# EAGLE design arm_debug (EAGLE 9.5.1)
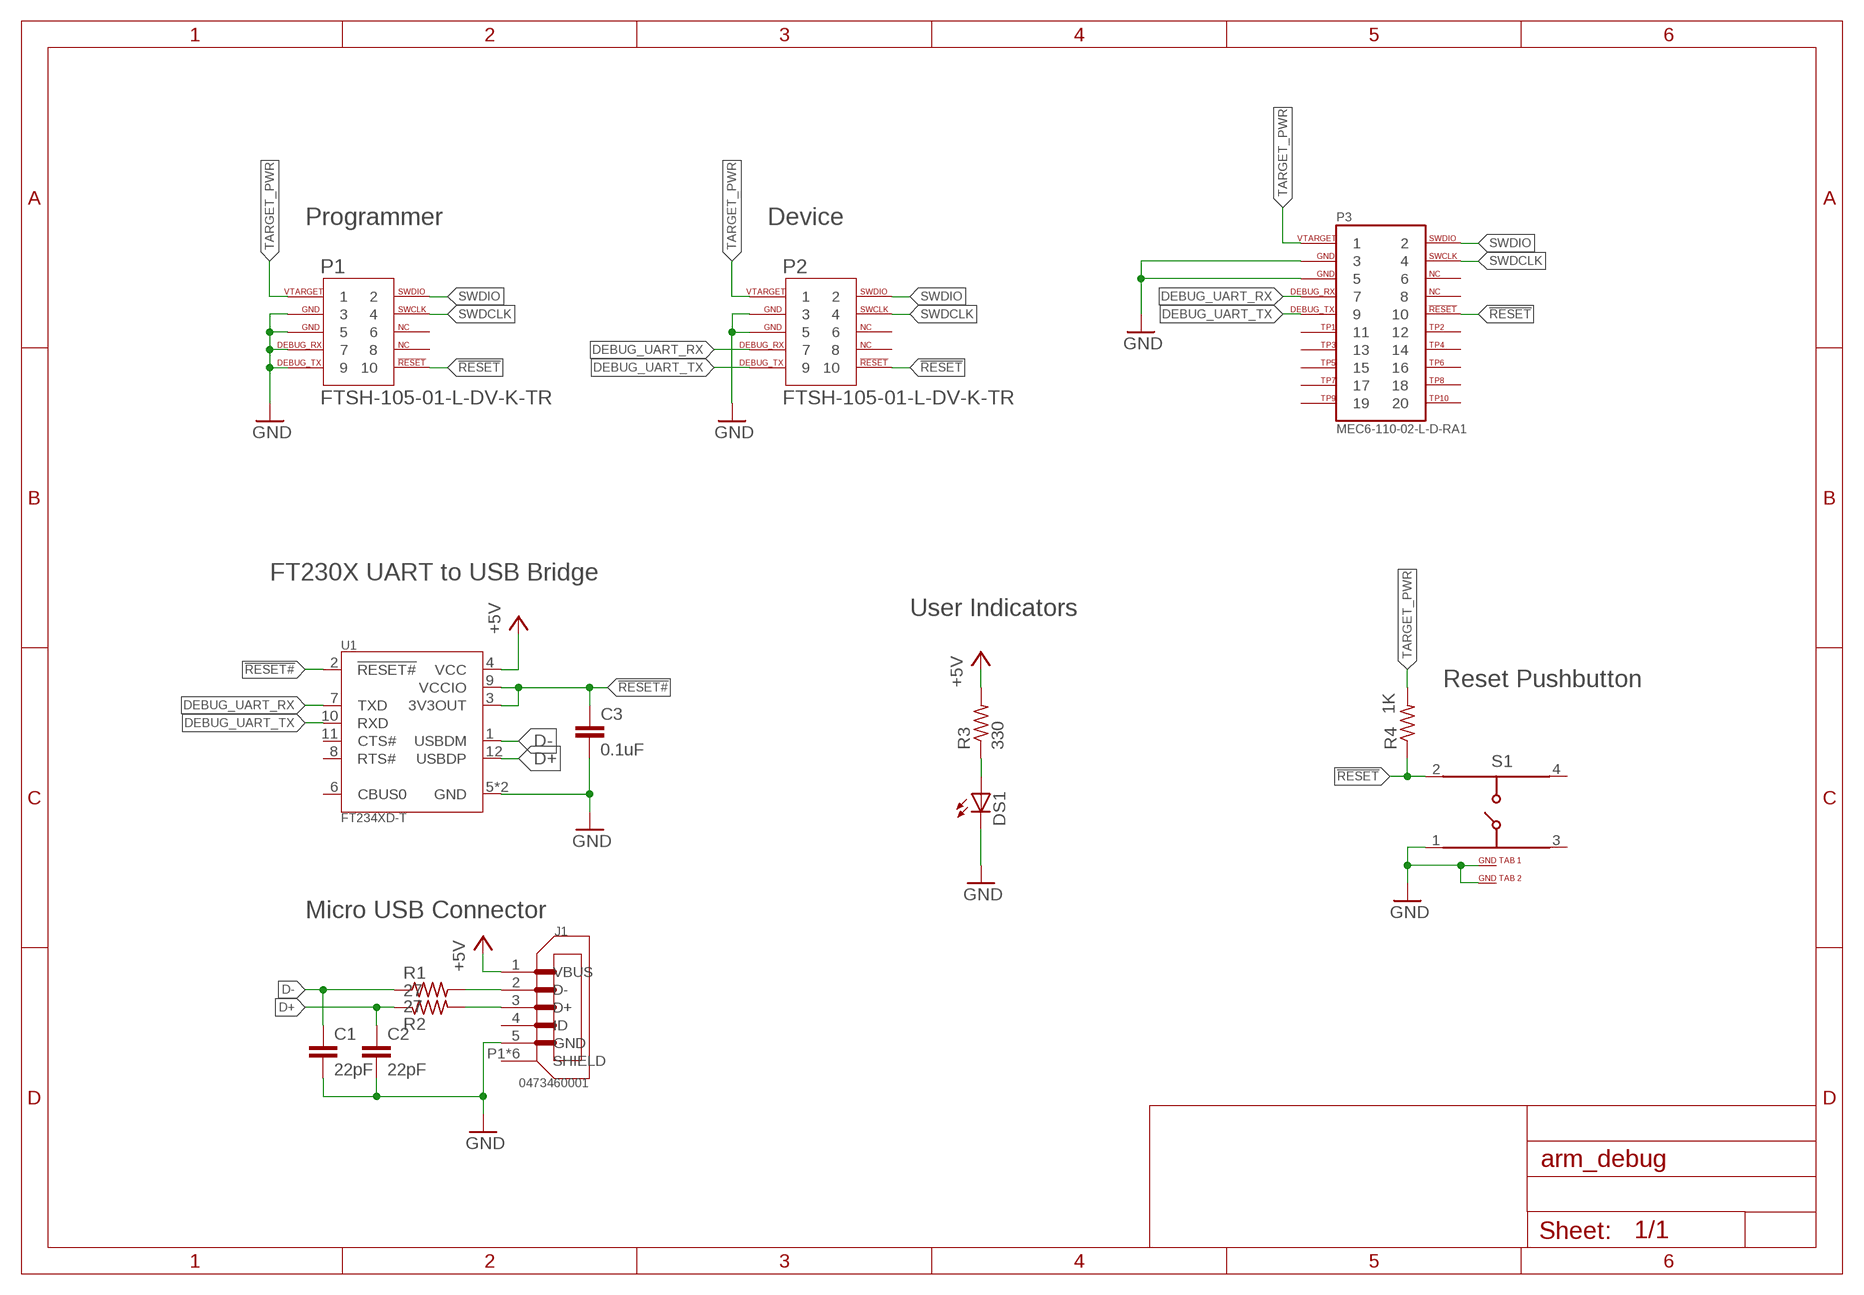
[diagram p0: schematic, sheet 1]

## Parts
C1  22pF  C0603C220M4RACAUTO  [M0603]
C2  22pF  C0603C220M4RACAUTO  [M0603]
C3  0.1uF  0603YC104KAT2A  [M0603]
DS1  LED0603  [0603]
J1  0473460001  MOLEX_MICRO_USB  [047346-0001]
P1  FTSH-105-01-L-DV-K-TR  SWD-CORTEX  [SAMTEC_FTSH-105-01-L-DV-K]
P2  FTSH-105-01-L-DV-K-TR  SWD-CORTEX  [SAMTEC_FTSH-105-01-L-DV-K]
P3  MEC6-110-02-L-D-RA1  SWD-MEC10-F  [MEC6-110-02-X-D-RAX-F]
R1  27  ESR03EZPJ270-27  [M0603]
R2  27  ESR03EZPJ270-27  [M0603]
R3  330  RR0816P-331-D  [M0603]
R4  1K  RR0816P-102-D  [M0603]
S1  431181015816  [431181015816]
U1  FT234XD-T  [DFN-12]

## Nets
!RESET: P1.10 P2.10 P3.10 R4.1 S1.2
!RESET#: C3.1 U1.2(!RESET#) U1.3(3V3OUT) U1.9(VCCIO)
+5V: J1.1(VBUS) R3.2 U1.4(VCC)
D+: C2.1 R2.1 U1.12(USBDP)
D-: C1.1 R1.1 U1.1(USBDM)
DEBUG_UART_RX: P2.7 P3.7 U1.7(TXD)
DEBUG_UART_TX: P2.9 P3.9 U1.10(RXD)
GND: C1.2 C2.2 C3.2 DS1.C J1.5(GND) P1.3 P1.5 P1.7 P1.9 P2.3 P2.5 P3.3 P3.5 S1.1 S1.GND1 S1.GND2 U1.5(GND) U1.13(GND)
N$2: J1.2(D-) R1.2
N$3: DS1.A R3.1
N$4: J1.3(D+) R2.2
SWDCLK: P1.4 P2.4 P3.4
SWDIO: P1.2 P2.2 P3.2
TARGET_PWR: P1.1 P2.1 P3.1 R4.2
Unconnected: J1.4(ID) J1.P1(SHIELD) J1.P2(SHIELD) J1.P3(SHIELD) J1.P4(SHIELD) J1.P5(SHIELD) J1.P6(SHIELD) P1.6 P1.8 P2.6 P2.8 P3.6 P3.8 P3.11 P3.12 P3.13 P3.14 P3.15 P3.16 P3.17 P3.18 P3.19 P3.20 S1.3 S1.4 U1.6(CBUS0) U1.8(RTS#) U1.11(CTS#)

## Notes on the sheet
- Programmer | Device
- FT230X UART to USB Bridge
- User Indicators
- Reset Pushbutton
- Micro USB Connector

## Library data of the parts
C1 C2 = capacitors:C0603C: CAP CER 0603 16V X7R; MF: Kemet; MP: C0603C220M4RACAUTO
C3 = capacitors:0603YC: 16V Ceramic Capacitor X7R 0603; MF: AVX; MP: 0603YC104KAT2A
DS1 = leds:LED
J1 = board_connectivity:MOLEX_MICRO_USB: Conn Micro USB Type B RCP 5 POS 0.65mm Solder RA SMD 5 Terminal 1 Port T/R; MF: Molex; MP: 0473460001
P1 P2 = programming_headers:SWD: SWD Programming Interface; MF: Samtec; MP: FTSH-105-01-L-DV-K-TR
P3 = programming_headers:SWD-MEC10: 0.635mm RIGHT ANGLE EDGE CARD ASSEMBLY; MF: Samtec; MP: MEC6-110-02-L-D-RA1
R1 R2 = resistors:ESR03EZPJ270: RES SMD 27 OHM 5% 1/4W 0603; MF: Rohm; MP: ESR03EZPJ270
R3 = resistors:RR0816P: M0603 SMD Resistor - 1/16W; MF: Susumu; MP: RR0816P-331-D
R4 = resistors:RR0816P: M0603 SMD Resistor - 1/16W; MF: Susumu; MP: RR0816P-102-D
S1 = switches:431181015816: Switch Tactile Spst-No 0.02a 15v; MF: Wurth Electronics; MP: 431151015826
U1 = USB:FT234XD-T: USB Full Speed to Basic UART IC with USB Charger Detection; MF: FTDI; MP: FT234XD-T

## Board
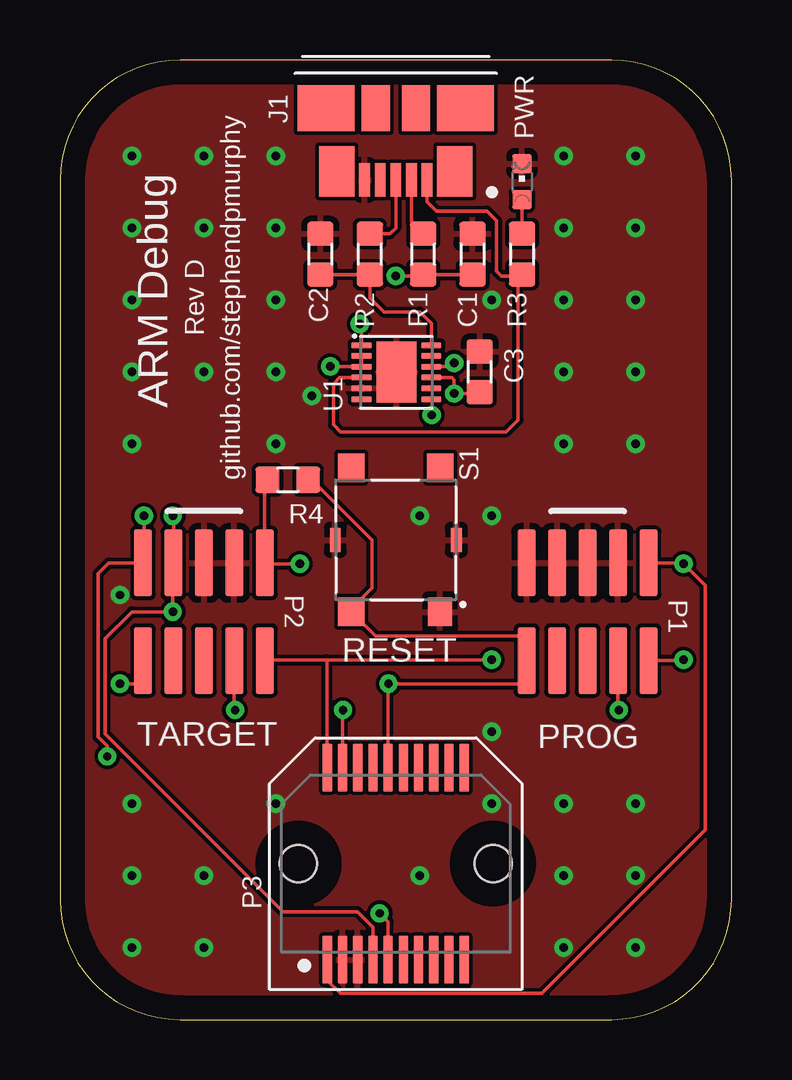
[diagram p1: board, top side]
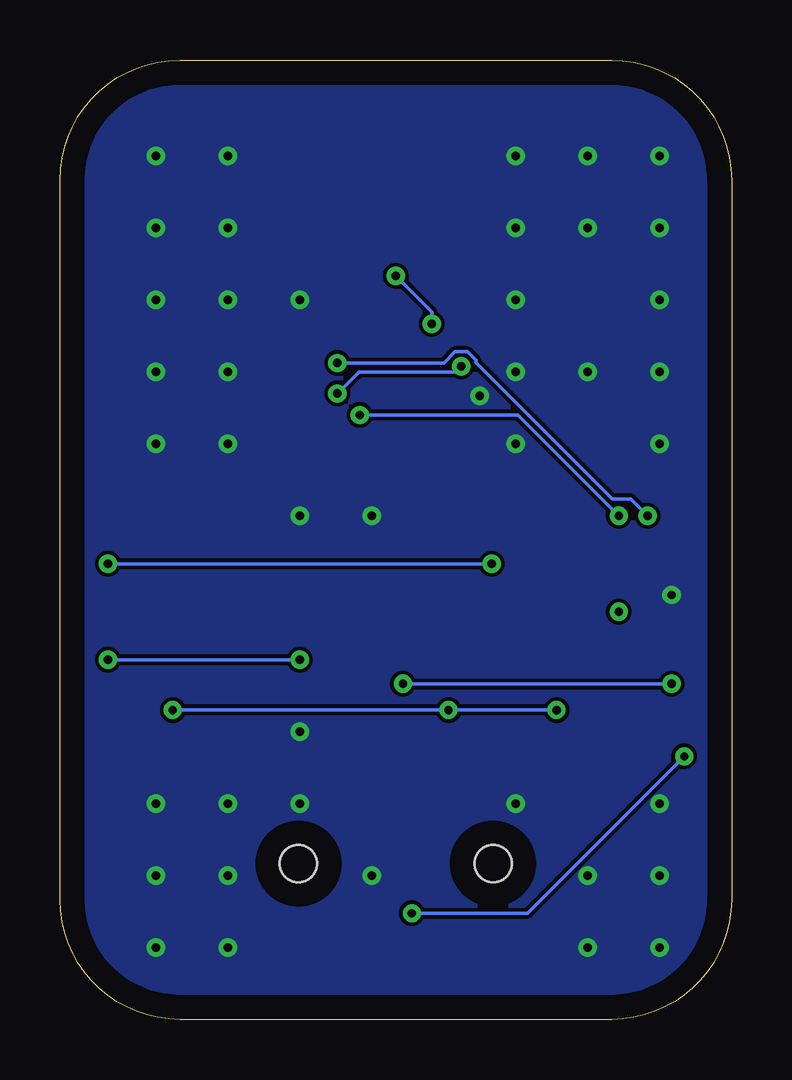
[diagram p2: board, bottom side, seen from below]

Size 28 x 40 mm. Coordinates in mm from the lower left corner, seen from the top.
Outline: 28,5 28,35 arc90 23,40 5,40 arc90 0,35 0,5 arc90 5,0 23,0 arc90 28,5
Copper layers (1*16): Top 0.035mm / dielectric 1.5mm / Bottom 0.035mm
Design rules "default *": minimum track width 6mil, minimum drill 0.35mm, track to track 6mil, track to pad 6mil, pad to pad 6mil, via to via 6mil, smd to smd 6mil, copper to edge 40mil, drill to drill 6mil, minimum pad ring 10mil, minimum via ring 8mil, stop-mask expansion 4mil, vias tented up to drill 100mil, thermal gap 10mil

### Footprints (pad centres in the part's own frame; a part is rotated, then mirrored left to right if it is on the bottom)
M0603 = smd 1 x 1.1: 1 -0.85,0; 2 0.85,0
0603 = smd 0.8 x 0.8: A 0,-0.75; C 0,0.75
047346-0001 = smd 0.45 x 1.38: 1 -1.3,0; 2 -0.65,0; 3 0,0; 4 0.65,0; 5 1.3,0 | smd 1.475 x 2.1: P1 -2.462,-0.36; P2 2.462,-0.36 | smd 2.375 x 1.9: P3 -2.913,-2.99; P6 2.913,-2.99 | smd 1.175 x 1.9: P4 -0.838,-2.99; P5 0.838,-2.99
SAMTEC_FTSH-105-01-L-DV-K = smd 0.762 x 2.794: 1 -2.54,-2.032; 2 -2.54,2.032; 3 -1.27,-2.032; 4 -1.27,2.032; 5 0,-2.032; 6 0,2.032; 7 1.27,-2.032; 8 1.27,2.032; 9 2.54,-2.032; 10 2.54,2.032
MEC6-110-02-X-D-RAX-F = smd 0.4 x 2: 1 -2.857,-4; 2 -2.857,4; 3 -2.223,-4; 4 -2.223,4; 5 -1.587,-4; 6 -1.587,4; 7 -0.953,-4; 8 -0.953,4; 9 -0.318,-4; 10 -0.318,4; 11 0.318,-4; 12 0.318,4; 13 0.953,-4; 14 0.953,4; 15 1.587,-4; 16 1.587,4; 17 2.223,-4; 18 2.223,4; 19 2.857,-4; 20 2.857,4 | hole 1.55: -4.06,0; 4.06,0
431181015816 = smd 1.2 x 1: 1 -3,-1.85 | smd 1.2 x 1.1: 2 -3,1.85; 3 3,-1.85; 4 3,1.85 | smd 1 x 0.45: GND1 0,2.525; GND2 0,-2.525
DFN-12 = smd 0.85 x 0.25: 1 -1.45,1.125; 2 -1.45,0.675; 3 -1.45,0.225; 4 -1.45,-0.225; 5 -1.45,-0.675; 6 -1.45,-1.125; 7 1.45,-1.125; 8 1.45,-0.675; 9 1.45,-0.225; 10 1.45,0.225; 11 1.45,0.675; 12 1.45,1.125 | smd 1.65 x 2.55: 13 0,0

### Placement (x,y rotation side)
C1  17.2,31.91 90 top
C2  10.86,31.91 90 top
C3  17.5,27 90 top
DS1  19.27,34.93 0 top
J1  14,35 180 top
P1  22,17 180 top
P2  6,17 180 top
P3  14,6.5 0 top
R1  15.14,31.91 90 top
R2  12.92,31.91 90 top
R3  19.27,31.91 270 top
R4  9.5,22.5 180 top
S1  14,20 90 top
U1  14.03,26.99 0 top

### Tracks (layer width: path | path; a pad name or v marks a point on that pad's centre or on a via)
!RESET  (via drill 0.35)
  Top 0.152: P3.10 13.68,13.98 v13.7,14 19.3,14 19.46,14.16 P1.10 19.46,15.76 19.5,15.8 19.3,16 13.15,16 S1.2 12.15,17.15 13,18 13,20 10.5,22.5 R4.1 | v2.5,14 3.4,14 3.46,14.06 P2.10
  Bottom 0.152: v13.7,14 v2.5,14
!RESET#  (via drill 0.35)
  Top 0.152: U1.2 U1.3 11.29,27.21 v11.27,27.23 | C3.1 17.45,26.1 v16.44,26.1 16.44,26.66 16.34,26.76 U1.9
  Bottom 0.152: v11.27,27.23 11.5,27 15.54,27 v16.44,26.1
+5V
  Top 0.152: J1.1 15.3,34.1 15.7,33.7 17.8,33.7 18.2,33.3 18.2,31.2 18.4,31 19.21,31 | 19.21,31 R3.2 | U1.4 11.66,26.76 11.4,26.5 11.4,24.8 11.7,24.5 18.6,24.5 19.1,25 19.1,30.89 19.21,31
D+
  Top 0.152: 12.8,31.06 R2.1 12.92,30.08 13.5,29.5 15,29.5 15.48,29.02 U1.12 | 12.8,31.06 C2.1 | 12.58,30.84 12.8,31.06
D-  (via drill 0.35)
  Top 0.152: 15.3,31.06 R1.1 15.08,31 v14,31 | 15.3,31.06 C1.1 | 15.48,30.88 15.3,31.06 | v12.5,29 12.58,28.92 U1.1
  Bottom 0.152: v14,31 12.5,29.5 v12.5,29
DEBUG_UART_RX  (via drill 0.35)
  Top 0.152: U1.7 15.5,25.84 v15.5,25.2 | P2.7 4.73,19.1 | 4.73,19.1 4.73,20.97 v4.7,21 | P3.7 13.05,3.85 12.4,4.5 9.3,4.5 1.89,11.91 1.89,15.89 3,17 v4.7,17 4.7,19.07 4.73,19.1
  Bottom 0.152: v4.7,21 8.9,25.2 v15.5,25.2
DEBUG_UART_TX  (via drill 0.35)
  Top 0.152: U1.10 16.28,27.21 v16.44,27.37 | v3.5,21 3.5,19.07 P2.9 2.03,19.03 1.59,18.59 1.59,11.78 1.97,11.4 v1.97,10.97 | P3.9 13.68,4.08 v13.33,4.43
  Bottom 0.152: v16.44,27.37 11.99,27.37 11.52,27.84 11.02,27.84 10.66,27.48 10.66,27.39 4.97,21.7 4.2,21.7 v3.5,21 | v13.33,4.43 8.51,4.43 v1.97,10.97
GND  (via drill 0.35)
  other vias: 2.5,17.7 10.5,26 3,36 6,36 9,36 9,33 9,30 9,27 3,24 9,24 3,6 3,3 6,3 24,3 24,9 21,9 21,6 18,12 18,9 15,6 9,9 21,24 24,24 24,27 21,27 21,30 24,30 24,33 21,33 21,36 24,36 18,21 15,21 3,9 6,6 21,3 24,6 18,30 3,30 3,33 6,33 6,27 3,27
  pour Top: -1.27,41.02 29.07,41.02 29.07,-1.27 -1.27,-1.27
  pour Bottom: -2.54,42.29 30.34,42.29 30.34,-2.54 -2.54,-2.54
N$2
  Top 0.152: R1.2 14.65,33.25 J1.2
N$3
  Top 0.152: R3.1 DS1.A
N$4
  Top 0.152: R2.2 13.76,32.76 14,33 J1.3
SWDCLK  (via drill 0.35)
  Top 0.152: P2.4 7.27,12.93 v7.3,12.9 | v23.3,12.9 23.27,12.93 P1.4 | P3.4 11.78,12.88 v11.8,12.9
  Bottom 0.152: v7.3,12.9 v11.8,12.9 v23.3,12.9
SWDIO  (via drill 0.35)
  Top 0.152: P2.2 8.57,15 11.1,15 | 11.1,15 v18,15 | v26,15 25.97,14.97 P1.2 | P3.2 11.14,14.96 11.1,15
  Bottom 0.152: v18,15 v26,15
TARGET_PWR  (via drill 0.35)
  Top 0.152: P2.1 8.57,19 v10,19 | P1.1 25.97,19.03 v26,19 26.91,18.09 26.91,7.91 20.09,1.09 11.69,1.09 11.14,1.64 P3.1 | 8.6,19.09 P2.1 | R4.2 8.54,22.39 P2.1
  Bottom 0.152: v10,19 v26,19

### Text on the board
tNames: PWR | Rev D | ARM Debug | github.com/stephendpmurphy | RESET | TARGET | PROG